# EAGLE design hbridge_v2 (EAGLE 9.2.2)
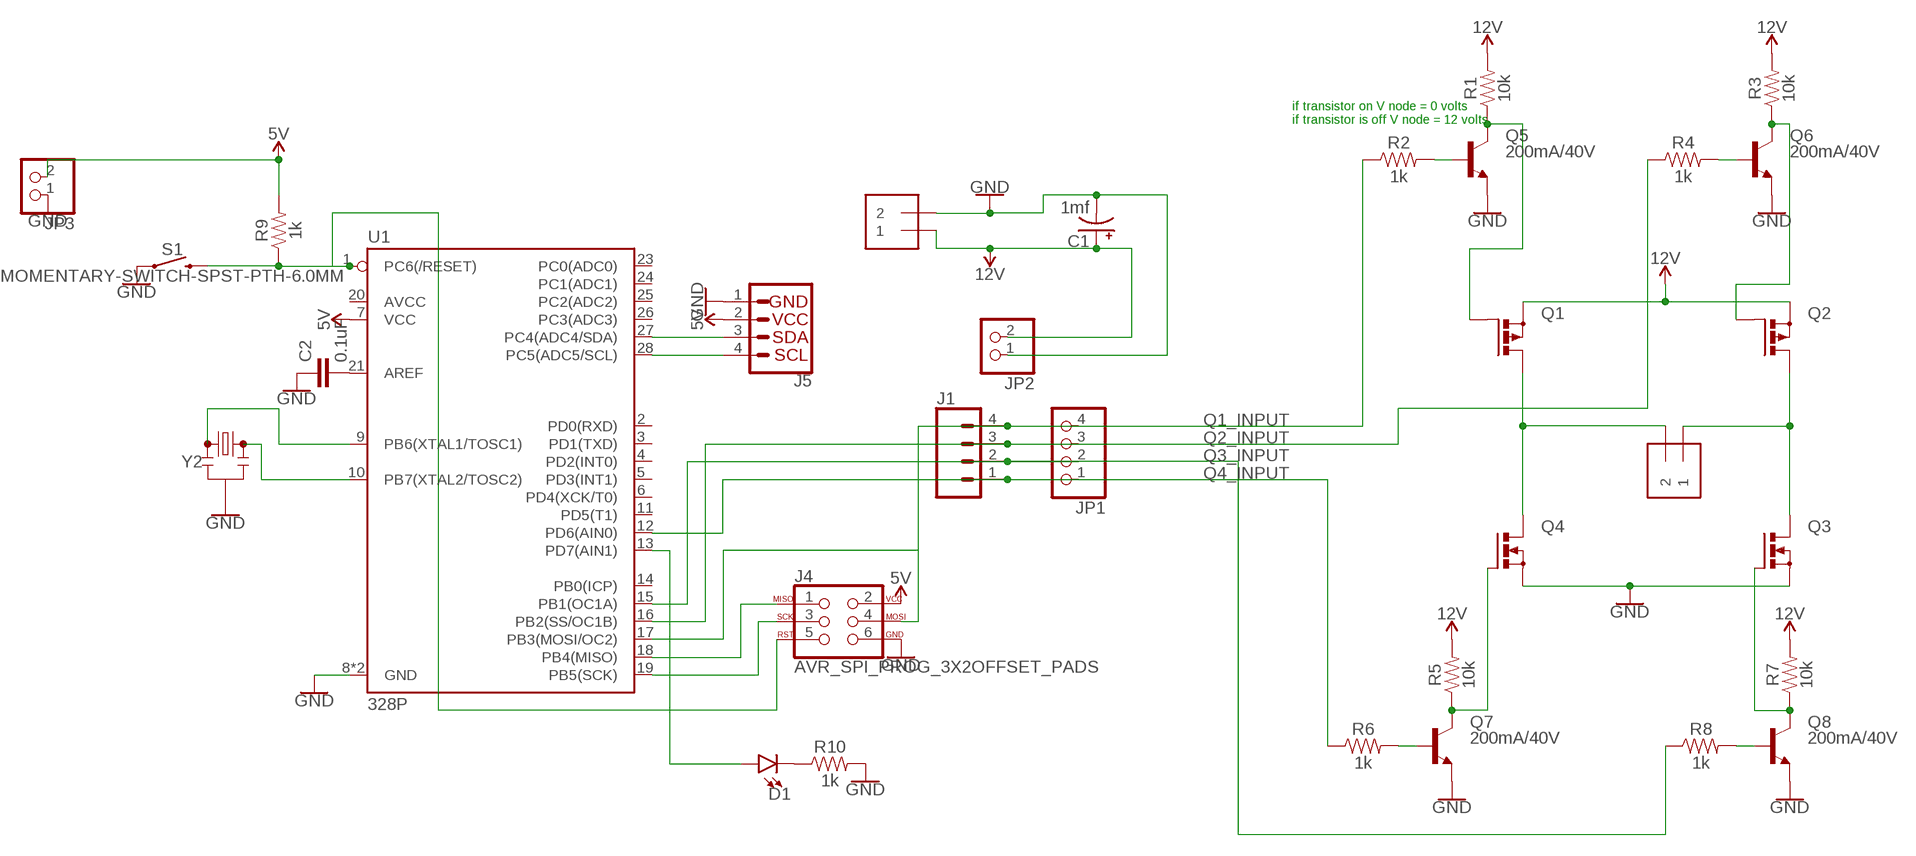
[diagram p0: schematic, sheet 1]

## Parts
C1  1mf  1000UF-RADIAL-5MM-35V-20%-KIT  [CPOL-RADIAL-5MM-10MM-KIT]
C2  0.1uF  0.1UF-KIT-EZ-50V-20%  [CAP-PTH-SMALL-KIT]
D1  LED3MM  [LED_3MM]
J1  CONN_04LONGPADS  [1X04_LONGPADS]
J2  1X2-3.5MM  [1X2-3.5MM]
J3  1X2-3.5MM  [1X2-3.5MM]
J4  AVR_SPI_PROG_3X2OFFSET_PADS  [2X3_OFFSET]
J5  I2C_STANDARD  [1X04]
JP1  PINHD-1X4  [1X04]
JP2  PINHD-1X2  [1X02]
JP3  PINHD-1X2  [1X02]
Q1  PMOSFET_PTO220BV  [TO220BV]
Q2  PMOSFET_PTO220BV  [TO220BV]
Q3  PMOSFET_NTO220BV  [TO220BV]
Q4  PMOSFET_NTO220BV  [TO220BV]
Q5  200mA/40V  TRANS_NPN-2N3904  [TO-92]
Q6  200mA/40V  TRANS_NPN-2N3904  [TO-92]
Q7  200mA/40V  TRANS_NPN-2N3904  [TO-92]
Q8  200mA/40V  TRANS_NPN-2N3904  [TO-92]
R1  10k  10KOHM-HORIZ-1/4W-1%  [AXIAL-0.3]
R2  1k  1KOHM-HORIZ-1/4W-5%  [AXIAL-0.3]
R3  10k  10KOHM-HORIZ-1/4W-1%  [AXIAL-0.3]
R4  1k  1KOHM-HORIZ-1/4W-5%  [AXIAL-0.3]
R5  10k  10KOHM-HORIZ-1/4W-1%  [AXIAL-0.3]
R6  1k  1KOHM-HORIZ-1/4W-5%  [AXIAL-0.3]
R7  10k  10KOHM-HORIZ-1/4W-1%  [AXIAL-0.3]
R8  1k  1KOHM-HORIZ-1/4W-5%  [AXIAL-0.3]
R9  1k  1KOHM-HORIZ-1/4W-5%  [AXIAL-0.3]
R10  1k  1KOHM-HORIZ-1/4W-5%  [AXIAL-0.3]
S1  MOMENTARY-SWITCH-SPST-PTH-6.0MM  [TACTILE_SWITCH_PTH_6.0MM]
U1  328P  ATMEGA328P_PDIP  [DIP28]
Y2  RESONATORPTH-7.6X3.8  [RESONATOR-PTH-7.6X3.8]

## Nets
5V: J4.2 J5.2 JP3.2 R9.P$2 U1.7(VCC)
12V: C1.+ J3.1 JP2.2 Q1.S Q2.S R1.P$2 R3.P$2 R5.P$2 R7.P$2
GND: C1.- C2.1 J3.2 J4.6 J5.1 JP2.1 JP3.1 Q3.S Q4.S Q5.1(E) Q6.1(E) Q7.1(E) Q8.1(E) R10.P$2 S1.1 U1.8(GND) U1.22(GND) Y2.2
N$1: J2.1 Q2.D Q3.D
N$2: J2.2 Q1.D Q4.D
N$3: Q5.2(B) R2.P$2
N$4: U1.10(PB7(XTAL2/TOSC2)) Y2.3
N$5: U1.9(PB6(XTAL1/TOSC1)) Y2.1
N$6: Q1.G Q5.3(C) R1.P$1
N$7: J4.5 R9.P$1 S1.3 U1.1(PC6(/RESET))
N$8: Q2.G Q6.3(C) R3.P$1
N$9: Q6.2(B) R4.P$2
N$10: Q4.G Q7.3(C) R5.P$1
N$11: Q7.2(B) R6.P$2
N$12: Q3.G Q8.3(C) R7.P$1
N$13: Q8.2(B) R8.P$2
N$14: C2.2 U1.21(AREF)
N$15: J4.1 U1.18(PB4(MISO))
N$16: J4.3 U1.19(PB5(SCK))
N$17: D1.A U1.13(PD7(AIN1))
N$18: D1.K(C) R10.P$1
N$19: J5.3 U1.27(PC4(ADC4/SDA))
N$20: J5.4 U1.28(PC5(ADC5/SCL))
Q1_INPUT: J1.4 J4.4 JP1.4 R2.P$1 U1.17(PB3(MOSI/OC2))
Q2_INPUT: J1.3 JP1.3 R4.P$1 U1.16(PB2(SS/OC1B))
Q3_INPUT: J1.2 JP1.2 R8.P$1 U1.15(PB1(OC1A))
Q4_INPUT: J1.1 JP1.1 R6.P$1 U1.12(PD6(AIN0))
Unconnected: U1.2(PD0(RXD)) U1.3(PD1(TXD)) U1.4(PD2(INT0)) U1.5(PD3(INT1)) U1.6(PD4(XCK/T0)) U1.11(PD5(T1)) U1.14(PB0(ICP)) U1.20(AVCC) U1.23(PC0(ADC0)) U1.24(PC1(ADC1)) U1.25(PC2(ADC2)) U1.26(PC3(ADC3))

## Notes on the sheet
- if transistor on V node = 0 volts
  if transistor is off V node = 12 volts

## Library data of the parts
C1 = SparkFun-Capacitors:1000UF: 1,000µF/1mF ceramic capacitors A capacitor is a passive two-terminal electrical component used to store electrical energy temporarily in an electric field. CAP-08070; PROD_ID: CAP-09538
C2 = SparkFun-Capacitors:0.1UF: 0.1µF ceramic capacitors A capacitor is a passive two-terminal electrical component used to store electrical energy temporarily in an electric field.; PROD_ID: CAP-08370
D1 = SparkFun-LED:LED: LED (Generic) Standard schematic elements and footprints for 5mm, 3mm, 1206, and 0603 sized LEDs. Generic LEDs with no color specified.; PROD_ID: DIO-08794
J1 = SparkFun-Connectors:CONN_04: Multi connection point. Often used as Generic Header-pin footprint for 0.1 inch spaced/style header connections On any of the 0.1 inch spaced packages, you can populate with these: Break Away Headers - Straight <https://www.sparkfun.com/products/116> (PRT-00116) Break Away Male Headers - Right Angle <https://www.sparkfun.com/products/553> (PRT-00553) Female Headers <https://www.sparkfun.com/products/115> (PRT-00115) Break Away Headers - Machine Pin <https://www.sparkfun.com/products/117> (PRT-00117) Break Away Female Headers - Swiss Machine Pin <https://www.sparkfun.com/products/743> (PRT-00743) For SCREWTERMINALS and SPRING TERMINALS visit here: Screw Terimnals on SparkFun.com <https://www.sparkfun.com/search/results?term=Screw+Terminals> (5mm/3.5mm/2.54mm spacing) This device is also useful as a general connection point to wire up your design to another part of your project. Our various solder wires solder well into these plated through hole pads. Hook-Up Wire - Assortment (Stranded, 22 AWG) <https://www.sparkfun.com/products/11375> (PRT-11375) Hook-Up Wire - Assortment (Solid Core, 22 AWG) <https://www.sparkfun.com/products/11367> (PRT-11367) View the entire wire category on our website here <https://www.sparkfun.com/categories/141> Special notes: Molex polarized connector foot print use with SKU : PRT-08231 with associated crimp pins and housings. 1MM SMD Version SKU: PRT-10208; PROD_ID: CONN-09696
J2 J3 = adafruit:1X2: 3.5mm Terminal block http://www.ladyada.net/library/pcb/eaglelibrary.html
J4 = SparkFun-Connectors:AVR_SPI_PROG_3X2: AVR ISP 6 Pin This is the reduced ISP connector for AVR programming. Common on Arduino. This footprint will take up less PCB space and can be used with a 10-pin to 6-pin adapter such as SKU: BOB-08508 **Special note about "TEST_POINT" package. The stop mask is on the top side, so if you want your programming test points to be on the bottom of your board, make sure to place this package on the bottom side of the board. This also ensure that the orientation to program from the bottom side will be correct. SparkFun Products: SparkFun ISP Pogo Adapter <https://www.sparkfun.com/products/11591> - NS Tiny AVR Programmer <https://www.sparkfun.com/products/11801> -PTH
J5 = SparkFun-Connectors:I2C_STANDARD: SparkFun I2C Standard Pinout Header SparkFun has standardized on a pinout for all I2C based sensor breakouts. This pinout allows I2C boards to be plugged directly into the headers on Arduino Uno compatible boards, and to be daisy chained easily. Example SparkFun Products: SparkFun Atmospheric Sensor Breakout - BME280 <https://www.sparkfun.com/products/13676> SparkFun Altitude/Pressure Sensor Breakout - MPL3115A2 <https://www.sparkfun.com/products/11084> SparkFun TOF Range Finder Sensor - VL6180 <https://www.sparkfun.com/products/12785>
JP1 = DC_LOAD_AU:PINHD-1X4: PIN HEADER
JP2 JP3 = DC_LOAD_AU:PINHD-1X2: PIN HEADER
Q1 Q2 = transistor-power:PMOSFET_P: Power MOSFET P-Channel
Q3 Q4 = transistor-power:PMOSFET_N: Power MOSFET N-Channel
Q5-Q8 = SparkFun-DiscreteSemi:TRANS_NPN: NPN transistor Current controlled devices typically used to amplify current or used as a switch. BC547 - COM-08928 <http://www.sparkfun.com/products/8928> (TO-92 45V 100mA) (1.Collector 2.Base 3.Emitter) 2N3904 - COM-00521 <http://www.sparkfun.com/products/521> (TO-92 40V 200mA) (1.Emitter 2.Base 3.Collector) P2N2222A - COM-12852 <http://www.sparkfun.com/products/12852> (TO-92 40V 600mA) (1.Collector 2.Base 3.Emitter); PROD_ID: TRANS-08447
R1 R3 R5 R7 = SparkFun-Resistors:10KOHM: 10kΩ resistor A resistor is a passive two-terminal electrical component that implements electrical resistance as a circuit element. Resistors act to reduce current flow, and, at the same time, act to lower voltage levels within circuits. - Wikipedia; PROD_ID: RES-12183
R2 R4 R6 R8-R10 = SparkFun-Resistors:1KOHM: 1kΩ resistor A resistor is a passive two-terminal electrical component that implements electrical resistance as a circuit element. Resistors act to reduce current flow, and, at the same time, act to lower voltage levels within circuits. - Wikipedia; PROD_ID: RES-08380
S1 = SparkFun-Switches:MOMENTARY-SWITCH-SPST: Momentary Switch (Pushbutton) - SPST Normally-open (NO) SPST momentary switches (buttons, pushbuttons). Variants PTH-12MM - 12mm square, through-hole Momentary Pushbutton Switch - 12mm Square <https://www.sparkfun.com/products/9190> (COM-09190) PTH-6.0MM, PTH-6.0MM-KIT - 6.0mm square, through-hole Mini Pushbutton Switch <https://www.sparkfun.com/products/97> (COM-00097) KIT package intended for soldering kit's - only one side of pads' copper is exposed. PTH-RIGHT-ANGLE-KIT - Right-angle, through-hole Right Angle Tactile Button <https://www.sparkfun.com/products/10791> - Used on SparkFun BigTime Watch Kit <https://www.sparkfun.com/products/11734> SMD-12MM - 12mm square, surface-mount Tactile Button - SMD (12mm) <https://www.sparkfun.com/products/12993> (COM-12993) Used on SparkFun PicoBoard <https://www.sparkfun.com/products/11888> SMD-4.5MM - 4.5mm Square Trackball Switch Used on SparkFun Blackberry Trackballer Breakout <https://www.sparkfun.com/products/13169> SMD-4.6MMX2.8MM - 4.60mm x 2.80mm, surface mount Used on SparkFun SAMD21 Mini Breakout <https://www.sparkfun.com/products/13664> SMD-5.2MM, SMD-5.2-REDUNDANT - 5.2mm square, surface-mount Mini Pushbutton Switch - SMD <https://www.sparkfun.com/products/8720> (COM-08720) Used on Arduino Pro Mini <https://www.sparkfun.com/products/11114> REDUNDANT package connects both switch circuits together SMD-6.0X3.5MM - 6.0 x 3.5mm, surface mount Momentary Reset Switch SMD <https://www.sparkfun.com/products/8229> (COM-08229) SMD-6.2MM-TALL - 6.2mm square, surface mount Tactile Button - SMD (6mm) <https://www.sparkfun.com/products/12992> Used on SparkFun Digital Sandbox <https://www.sparkfun.com/products/12651> SMD-RIGHT-ANGLE - Right-angle, surface mount Used on SparkFun Block for Intel® Edison - Arduino <https://www.sparkfun.com/products/13036>; PROD_ID: SWCH-08441; SF_SKU: COM-00097
U1 = SparkFun-IC-Microcontroller:ATMEGA328P_PDIP: Atmel 328P Through hole ATMEGA328P uC used in the Arduino 32kb flash, 1k EEPROM, 2k SRAM Datasheet <http://www.sparkfun.com/datasheets/Components/SMD/ATMega328.pdf> SparkFun Products Storefront component: AVR 28 Pin 20MHz 32K 6A/D - ATMega328P <https://www.sparkfun.com/products/9061> (COM-09061) SparkFun Simon Says - Through-Hole Soldering Kit <https://www.sparkfun.com/products/10547> (KIT-10547) SparkFun Learn to Solder - Simon Says <https://www.sparkfun.com/products/13708> (KIT-13708) SparkFun BigTime Watch Kit <https://www.sparkfun.com/products/11734> (KIT-11734) SparkFun ClockIt <https://www.sparkfun.com/products/10930> (KIT-10930) SparkFun Serial Enabled LCD Kit <https://www.sparkfun.com/products/10097> (LCD-10097) SparkFun Simon Tilts - Through Hole Soldering Kit <https://www.sparkfun.com/products/12634> (KIT-12634) SparkFun Frequency Counter Kit <https://www.sparkfun.com/products/10140> (KIT-10140) FabFM Radio Kit <https://www.sparkfun.com/products/11043> (KIT-11043) SparkFun Binary Blaster Kit <https://www.sparkfun.com/products/12037> (KIT-12037) SparkFun Metro-Gnome <https://www.sparkfun.com/products/9236> (KIT-09236) ATmega328 with Arduino Optiboot (Uno) <https://www.sparkfun.com/products/10524> (DEV-10524); PROD_ID: IC-09136
Y2 = SparkFun-Clocks:RESONATOR: Resonators (Generic) Ceramic resonators are clock-generating components, often used to control timing in microcontrollers. They usually have 3 pins: two pins for oscillation, and one pin for ground. Compared to crystals, resonators have worse tolerance, but are usually much cheaper. Plus, they have built-in load capacitors! These devices are used on boards like the Arduino Pro 8MHz <https://www.sparkfun.com/products/11114> and Arduino Pro 16MHz <https://www.sparkfun.com/products/11113>.

## Board
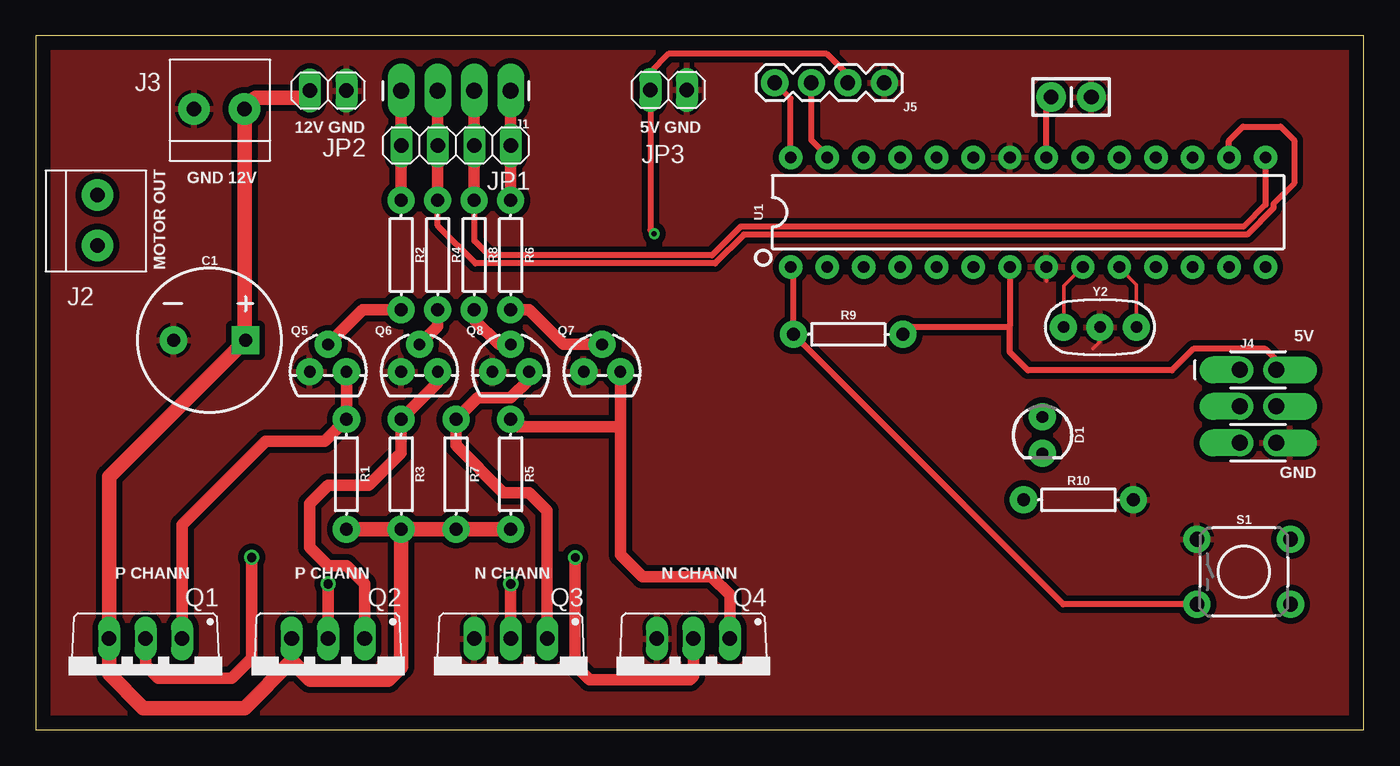
[diagram p1: board, top side]
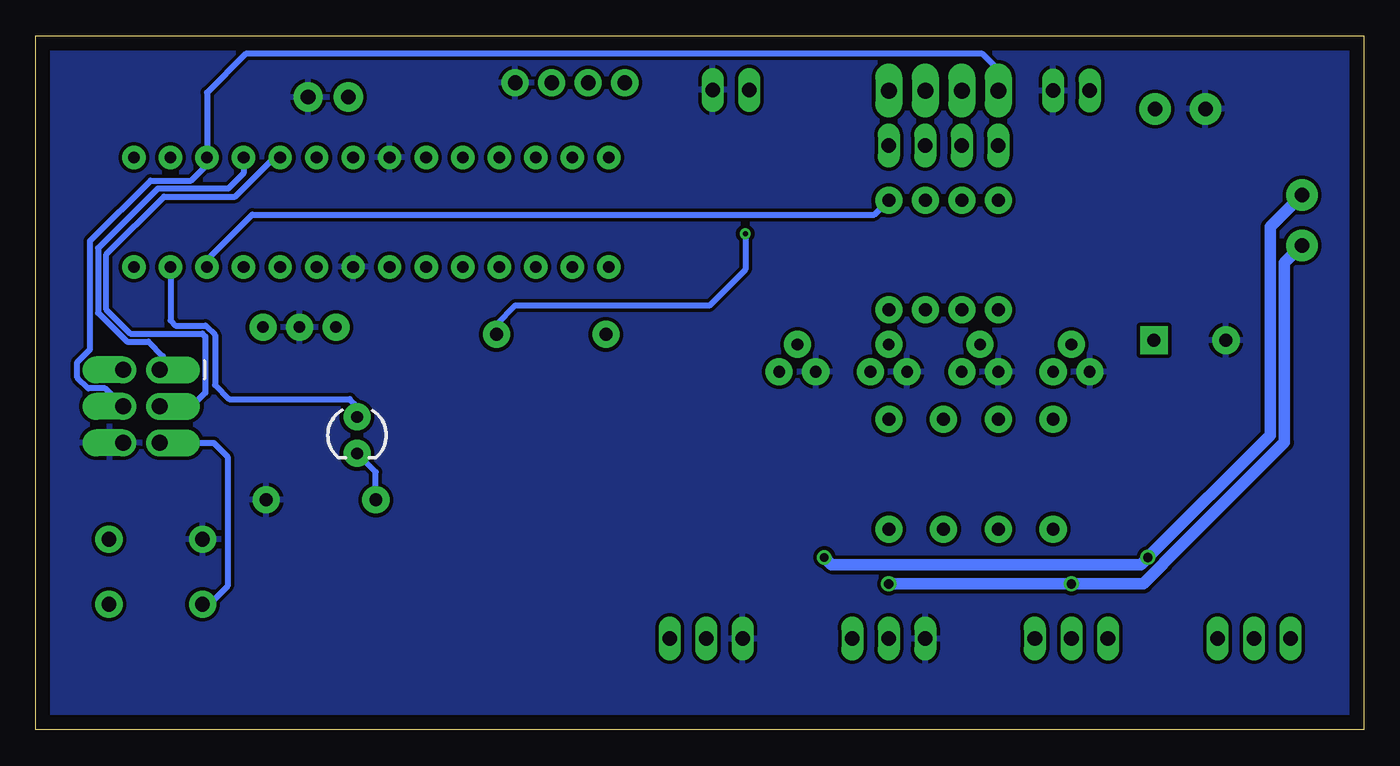
[diagram p2: board, bottom side, seen from below]

Size 92.33 x 48.25 mm. Coordinates in mm from the lower left corner, seen from the top.
Outline: 0,0 92.33,0 92.33,48.25 0,48.25 0,0
Copper layers (1*16): Top 0.035mm / dielectric 1.5mm / Bottom 0.035mm
Design rules "default": minimum track width 6mil, minimum drill 0.35mm, track to track 6mil, track to pad 6mil, pad to pad 6mil, via to via 6mil, smd to smd 6mil, copper to edge 40mil, drill to drill 6mil, minimum pad ring 10mil, minimum via ring 8mil, stop-mask expansion 4mil, vias tented up to drill 0mil, thermal gap 10mil

### Footprints (pad centres in the part's own frame; a part is rotated, then mirrored left to right if it is on the bottom)
CPOL-RADIAL-5MM-10MM-KIT = drill 0.9 pad 1.93 square: + 2.5,0 | drill 0.9 pad 1.93: - -2.5,0
CAP-PTH-SMALL-KIT = drill 1.016 pad 2.032: 1 -1.397,0; 2 1.397,0
LED_3MM = drill 0.813 pad 1.88: A -1.27,0; K 1.27,0
1X04_LONGPADS = drill 1.118 pad 1.88 long: 1 0,0; 2 2.54,0; 3 5.08,0; 4 7.62,0
1X2-3.5MM = drill 1 pad 2.184: 1 1.8,0; 2 -1.7,0
2X3_OFFSET = drill 1.118 pad 1.88 offset: 1 -2.54,-1.27; 2 -2.54,1.27; 3 0,-1.27; 4 0,1.27; 5 2.54,-1.27; 6 2.54,1.27
1X04 = drill 1.016 pad 1.88: 1 0,0; 2 2.54,0; 3 5.08,0; 4 7.62,0
1X04' = drill 1.016 long: 1 -3.81,0; 2 -1.27,0; 3 1.27,0; 4 3.81,0
1X02 = drill 1.016 long: 1 -1.27,0; 2 1.27,0
TO220BV = drill 1.016 long: D 0,-2.54; G -2.54,-2.54; S 2.54,-2.54
TO-92 = drill 0.813 pad 1.88: 1 -1.27,0; 2 0,1.905; 3 1.27,0
AXIAL-0.3 = drill 0.9 pad 1.88: P$1 -3.81,0; P$2 3.81,0
TACTILE_SWITCH_PTH_6.0MM = drill 1.016 pad 1.88: 1 -3.251,2.261; 2 3.251,2.261; 3 -3.251,-2.261; 4 3.251,-2.261
DIP28 = drill 0.813 pad 1.626: 1 -16.51,-3.81; 2 -13.97,-3.81; 3 -11.43,-3.81; 4 -8.89,-3.81; 5 -6.35,-3.81; 6 -3.81,-3.81; 7 -1.27,-3.81; 8 1.27,-3.81; 9 3.81,-3.81; 10 6.35,-3.81; 11 8.89,-3.81; 12 11.43,-3.81; 13 13.97,-3.81; 14 16.51,-3.81; 15 16.51,3.81; 16 13.97,3.81; 17 11.43,3.81; 18 8.89,3.81; 19 6.35,3.81; 20 3.81,3.81; 21 1.27,3.81; 22 -1.27,3.81; 23 -3.81,3.81; 24 -6.35,3.81; 25 -8.89,3.81; 26 -11.43,3.81; 27 -13.97,3.81; 28 -16.51,3.81
RESONATOR-PTH-7.6X3.8 = drill 0.8 pad 1.88: 1 -2.54,0; 2 0,0; 3 2.54,0

### Placement (x,y rotation side)
C1  12.07,27.1 0 top
C2  72,44 180 top
D1  70,20.5 270 top
J1  33.02,44.45 180 top
J2  4.28,35.49 270 top
J3  12.7,43.18 0 top
J4  85,22.5 270 top
J5  59,45 180 top
JP1  [1X04']  29.21,40.64 180 top
JP2  20.32,44.45 180 top
JP3  44,44.5 180 top
Q1  7.62,3.81 180 top
Q2  20.32,3.81 180 top
Q3  33.02,3.81 180 top
Q4  45.72,3.81 180 top
Q5  20.32,24.9 0 top
Q6  26.67,24.9 0 top
Q7  39.37,24.9 0 top
Q8  33.02,24.9 0 top
R1  21.59,17.78 270 top
R2  25.4,33.02 270 top
R3  25.4,17.78 270 top
R4  27.94,33.02 270 top
R5  33.02,17.78 270 top
R6  33.02,33.02 270 top
R7  29.21,17.78 270 top
R8  30.48,33.02 270 top
R9  56.5,27.5 0 top
R10  72.5,16 0 top
S1  84,11 0 top
U1  69,36 0 top
Y2  74,28 0 top

### Tracks (layer width: path | path; a pad name or v marks a point on that pad's centre or on a via)
5V  (via drill 0.35)
  Top 0.406: R9.P$2 60.83,28.02 67.67,28.02 67.73,28.08 | U1.7 67.73,28.08 | v43,34.5 42.73,34.77 JP3.2 42.73,45.73 44,47 55,47 56.46,45.54 J5.2 | J4.2 86.27,25.73 85.5,26.5 80.5,26.5 79,25 69,25 67.73,26.27 67.73,28.08
  Bottom 0.406: v43,34.5 43,32 45.5,29.5 59,29.5 60.31,28.19 R9.P$2
12V
  Top 1.016: JP2.2 18.55,43.95 15.27,43.95 J3.1 14.5,27.17 C1.+ 5.08,17.61 Q1.S 5.08,3.92 7.48,1.52 14.5,1.52 17.78,4.8 | R1.P$2 R3.P$2 | R3.P$2 R7.P$2 R5.P$2 | 17.78,4.8 Q2.S | R3.P$2 25.4,4.4 24.5,3.5 19.08,3.5 17.78,4.8
GND
  Top 0.254: 74,27 73.5,26.5 | 70.27,31.19 U1.8
  pour Top (isolate 0.406): -1.08,49.78 93.17,49.78 93.17,-1.31 -1.08,-1.31
  pour Bottom (isolate 0.254): -2.58,51.28 94.59,51.28 94.59,-2.58 -2.58,-2.58
N$1  (via drill 0.65)
  Top 0.813: 33.02,5.31 Q3.D v33.02,10.16 | Q2.D v20.32,10.16
  Bottom 0.813: v33.02,10.16 v20.32,10.16 15.3,10.16 13.91,11.55 13.91,11.59 5.5,20 5.5,32.47 J2.1
N$2  (via drill 0.6, 0.65)
  Top 0.813: Q1.D 7.62,4.49 8.5,3.61 13.61,3.61 15,5 v15,12 | v37.5,12 37.5,4.5 38.5,3.5 45.5,3.5 45.72,3.73 Q4.D
  Bottom 0.813: v37.5,12 37,11.5 15.5,11.5 v15,12 6.5,20.5 6.5,34.97 J2.2
N$3
  Top 0.813: Q5.2 22.73,29.21 R2.P$2
N$4
  Top 0.254: 75.2,32.04 75.33,32.17 | 75.33,32.17 U1.10 | Y2.3 76.54,30.96 75.33,32.17
N$5
  Top 0.254: U1.9 71.5,30.88 71.5,28.04 Y2.1
N$6
  Top 0.813: Q5.3 R1.P$1 20.09,20.09 15.97,20.09 10.16,14.28 Q1.G
N$7
  Top 0.406: S1.3 71.45,8.74 R9.P$1 52.69,31.99 U1.1
  Bottom 0.406: J4.5 79.96,19.96 79,19 79,10 80.26,8.74 S1.3
N$8
  Top 0.813: Q6.3 27.94,24.13 R3.P$1 25.4,19.28 23.13,17.01 20.32,17.01 19.05,15.74 19.05,12.7 20.32,11.43 21.59,11.43 22.86,10.16 Q2.G
N$9
  Top 0.813: Q6.2 27.94,28.07 R4.P$2
N$10
  Top 0.813: Q4.G 48.26,9.39 46.99,10.66 42.18,10.66 40.64,12.2 40.64,21.09 | Q7.3 40.64,21.09 | 40.64,21.09 33.52,21.09 R5.P$1
N$11
  Top 0.813: Q7.2 36.7,26.8 34.29,29.21 R6.P$2
N$12
  Top 0.813: Q3.G 35.56,15.24 34.29,16.51 32.48,16.51 29.21,19.78 R7.P$1 30.71,23.09 33.02,23.09 34.29,24.36 Q8.3
N$13
  Top 0.813: Q8.2 32.2,26.8 30.48,28.52 R8.P$2
N$14
  Top 0.406: U1.21 70.27,43.67 C2.2
N$15
  Bottom 0.254: U1.18 78,39.7
  Bottom 0.406: U1.18 77.89,38.7 78.95,37.64 83.86,37.64 88,33.5 88,29 86,27 84.5,27 83.5,26 83.5,25.27 J4.1
N$16
  Bottom 0.406: U1.19 75.74,39.81 78.47,37.08 83.42,37.08 87.44,33.06 87.44,29.23 85.77,27.56 80.77,27.56 80.56,27.34 80.56,23.45 81.5,22.5 J4.3
N$17
  Bottom 0.406: U1.13 82.97,28.47 82.62,28.12 80.54,28.12 79.88,27.46 79.88,24 78.88,23 70.5,23 70,22.5 D1.A
N$18
  Bottom 0.406: R10.P$1 68.69,17.92 D1.K
N$19
  Top 0.406: U1.27 55.03,39.89 53.92,41 J5.3
N$20
  Top 0.406: U1.28 52.49,43.89 J5.4
Q1_INPUT
  Top 0.813: J1.4 JP1.4 R2.P$1
  Bottom 0.406: J1.4 25.4,45.9 26.5,47 77.74,47 80.43,44.31 U1.17 80.43,39.31 81.54,38.2 84.36,38.2 88.56,34 88.56,26.46 89.44,25.58 89.44,24.5 88.69,23.75 87.52,23.75 J4.4
Q2_INPUT
  Top 0.406: U1.16 82.97,40.97 83.94,41.94 86.56,41.94 87.5,41 87.5,38 86.07,36.57 86.07,36.28 84.23,34.44 49.23,34.44 47.23,32.44 30.56,32.44 27.94,35.06 R4.P$1
  Top 0.813: J1.3 JP1.3 R4.P$1
Q3_INPUT
  Top 0.406: U1.15 85.51,36.51 84,35 49,35 47,33 31.5,33 30.5,34 30.5,36.81 R8.P$1
  Top 0.813: R8.P$1 JP1.2 J1.2
Q4_INPUT
  Top 0.813: R6.P$1 JP1.1 J1.1
  Bottom 0.406: R6.P$1 34.02,35.83 77.29,35.83 80.43,32.69 U1.12

### Text on the board
tNames: 12V GND | 5V GND | GND 12V | MOTOR OUT | 5V | GND | P CHANN | P CHANN | N CHANN | N CHANN